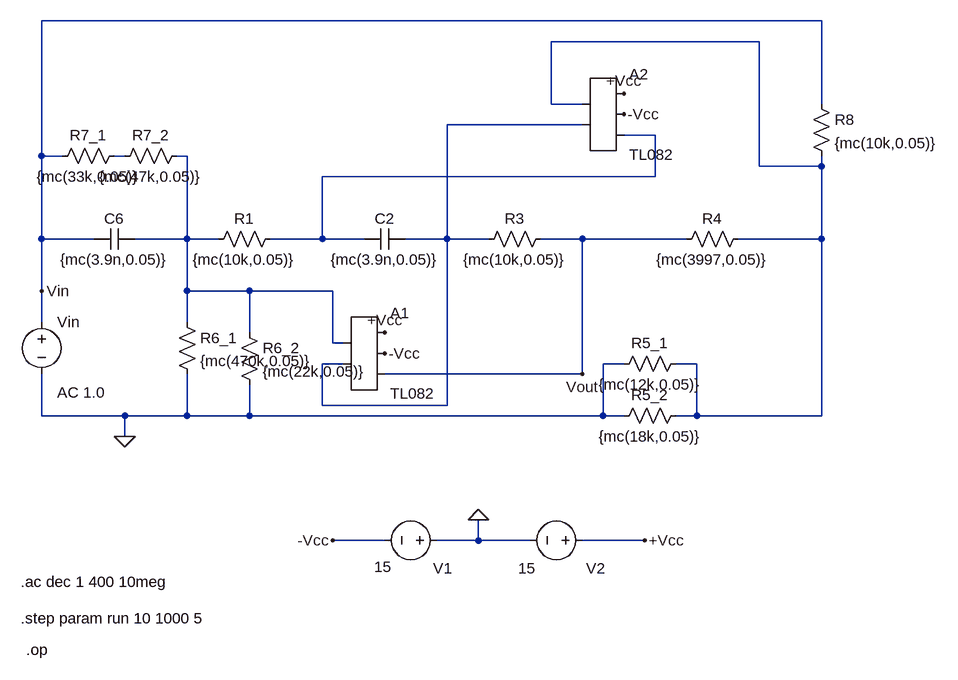
[diagram p0: schematic esquematico_spice_montecarlo.asc]
esquematico_spice_montecarlo.asc, the LTspice schematic file:
Version 4
SHEET 1 888 1080
WIRE 704 96 -496 96
WIRE 608 128 288 128
WIRE 288 224 288 128
WIRE 336 224 288 224
WIRE 704 224 704 96
WIRE 336 256 128 256
WIRE 448 272 400 272
WIRE -496 304 -496 96
WIRE -464 304 -496 304
WIRE -368 304 -384 304
WIRE -272 304 -288 304
WIRE 608 320 608 128
WIRE 704 320 704 304
WIRE 704 320 608 320
WIRE 448 336 448 272
WIRE 448 336 -64 336
WIRE -496 432 -496 304
WIRE -416 432 -496 432
WIRE -272 432 -272 304
WIRE -272 432 -352 432
WIRE -224 432 -272 432
WIRE -64 432 -64 336
WIRE -64 432 -144 432
WIRE 0 432 -64 432
WIRE 128 432 128 256
WIRE 128 432 64 432
WIRE 192 432 128 432
WIRE 336 432 272 432
WIRE 496 432 336 432
WIRE 704 432 704 320
WIRE 704 432 576 432
WIRE -496 512 -496 432
WIRE -272 512 -272 432
WIRE -176 512 -272 512
WIRE -48 512 -176 512
WIRE -496 560 -496 512
WIRE -272 560 -272 512
WIRE -176 576 -176 512
WIRE -48 592 -48 512
WIRE -32 592 -48 592
WIRE -32 624 -64 624
WIRE 400 624 368 624
WIRE 512 624 480 624
WIRE 336 640 336 432
WIRE 336 640 32 640
WIRE -64 688 -64 624
WIRE 128 688 128 432
WIRE 128 688 -64 688
WIRE -496 704 -496 640
WIRE -368 704 -496 704
WIRE -272 704 -272 640
WIRE -272 704 -368 704
WIRE -176 704 -176 656
WIRE -176 704 -272 704
WIRE 368 704 368 624
WIRE 368 704 -176 704
WIRE 400 704 368 704
WIRE 512 704 512 624
WIRE 512 704 480 704
WIRE 704 704 704 432
WIRE 704 704 512 704
WIRE -368 736 -368 704
WIRE 32 896 -48 896
WIRE 176 896 176 864
WIRE 176 896 112 896
WIRE 256 896 176 896
WIRE 432 896 336 896
FLAG -368 736 0
FLAG 336 640 Vout
FLAG -48 896 -Vcc
FLAG 432 896 +Vcc
FLAG 400 208 +Vcc
FLAG 32 576 +Vcc
FLAG 32 608 -Vcc
FLAG 400 240 -Vcc
FLAG 176 864 0
FLAG -496 512 Vin
SYMBOL voltage -496 544 R0
WINDOW 123 24 124 Left 2
WINDOW 39 0 0 Left 2
SYMATTR Value2 AC 1.0
SYMATTR InstName Vin
SYMATTR Value ""
SYMBOL cap -352 416 R90
WINDOW 0 0 32 VBottom 2
WINDOW 3 32 32 VTop 2
SYMATTR InstName C6
SYMATTR Value {mc(3.9n,0.05)}
SYMBOL res -288 544 R0
SYMATTR InstName R6_1
SYMATTR Value {mc(470k,0.05)}
SYMBOL res -192 560 R0
SYMATTR InstName R6_2
SYMATTR Value {mc(22k,0.05)}
SYMBOL res -368 288 R90
WINDOW 0 0 56 VBottom 2
WINDOW 3 32 56 VTop 2
SYMATTR InstName R7_1
SYMATTR Value {mc(33k,0.05)}
SYMBOL res -272 288 R90
WINDOW 0 0 56 VBottom 2
WINDOW 3 32 56 VTop 2
SYMATTR InstName R7_2
SYMATTR Value {mc(47k,0.05)}
SYMBOL res -128 416 R90
WINDOW 0 0 56 VBottom 2
WINDOW 3 32 56 VTop 2
SYMATTR InstName R1
SYMATTR Value {mc(10k,0.05)}
SYMBOL AutoGenerated\\TL082 0 608 R0
SYMATTR InstName A1
SYMBOL AutoGenerated\\TL082 368 240 R0
SYMATTR InstName A2
SYMBOL cap 64 416 R90
WINDOW 0 0 32 VBottom 2
WINDOW 3 32 32 VTop 2
SYMATTR InstName C2
SYMATTR Value {mc(3.9n,0.05)}
SYMBOL res 288 416 R90
WINDOW 0 0 56 VBottom 2
WINDOW 3 32 56 VTop 2
SYMATTR InstName R3
SYMATTR Value {mc(10k,0.05)}
SYMBOL res 592 416 R90
WINDOW 0 0 56 VBottom 2
WINDOW 3 32 56 VTop 2
SYMATTR InstName R4
SYMATTR Value {mc(3997,0.05)}
SYMBOL res 496 688 R90
WINDOW 0 0 56 VBottom 2
WINDOW 3 32 56 VTop 2
SYMATTR InstName R5_2
SYMATTR Value {mc(18k,0.05)}
SYMBOL res 496 608 R90
WINDOW 0 0 56 VBottom 2
WINDOW 3 32 56 VTop 2
SYMATTR InstName R5_1
SYMATTR Value {mc(12k,0.05)}
SYMBOL res 688 208 R0
SYMATTR InstName R8
SYMATTR Value {mc(10k,0.05)}
SYMBOL voltage 352 896 R90
WINDOW 0 43 -19 VRight 2
WINDOW 123 43 88 VRight 2
WINDOW 39 0 0 Left 2
SYMATTR InstName V2
SYMATTR Value2 15
SYMATTR Value ""
SYMBOL voltage 128 896 R90
WINDOW 0 43 -8 VRight 2
WINDOW 123 41 85 VRight 2
WINDOW 39 0 0 Left 2
SYMATTR InstName V1
SYMATTR Value2 15
SYMATTR Value ""
TEXT -528 960 Left 2 !.ac dec 1 400 10meg
TEXT -528 1016 Left 2 !.step param run 10 1000 5
TEXT -520 1064 Left 2 !.op

The netlist it stands for:
* esquematico_spice_montecarlo.asc
Vin Vin 0 AC 1.0
C6 N005 Vin {mc(3.9n,0.05)}
R6_1 N005 0 {mc(470k,0.05)}
R6_2 N005 0 {mc(22k,0.05)}
R7_1 N004 Vin {mc(33k,0.05)}
R7_2 N005 N004 {mc(47k,0.05)}
R1 N003 N005 {mc(10k,0.05)}
* A1: TL082 (symbol AutoGenerated\TL082 not available, pins judged from their places): pin1=N005 pin2=N002 pin3=+Vcc pin4=-Vcc pin5=Vout
* A2: TL082 (symbol AutoGenerated\TL082 not available, pins judged from their places): pin1=N001 pin2=N002 pin3=+Vcc pin4=-Vcc pin5=N003
C2 N002 N003 {mc(3.9n,0.05)}
R3 Vout N002 {mc(10k,0.05)}
R4 N001 Vout {mc(3997,0.05)}
R5_2 N001 0 {mc(18k,0.05)}
R5_1 N001 0 {mc(12k,0.05)}
R8 Vin N001 {mc(10k,0.05)}
V2 +Vcc 0 15
V1 0 -Vcc 15
.ac dec 1 400 10meg
.step param run 10 1000 5
.op
.backanno
.end